# EasyEDA Pro project ProPrj_承载我所有幻想的键盘_2025-02-09.epro, schematic 04-Schematic
Create Date: 2022-12-06; Page Name: P1; Project Name: 火星号键盘V2; Schematic Name: Schematic3; Update Date: 2022-12-06; Company: 嘉立创EDA; Page Size: A4; Version: V1.0
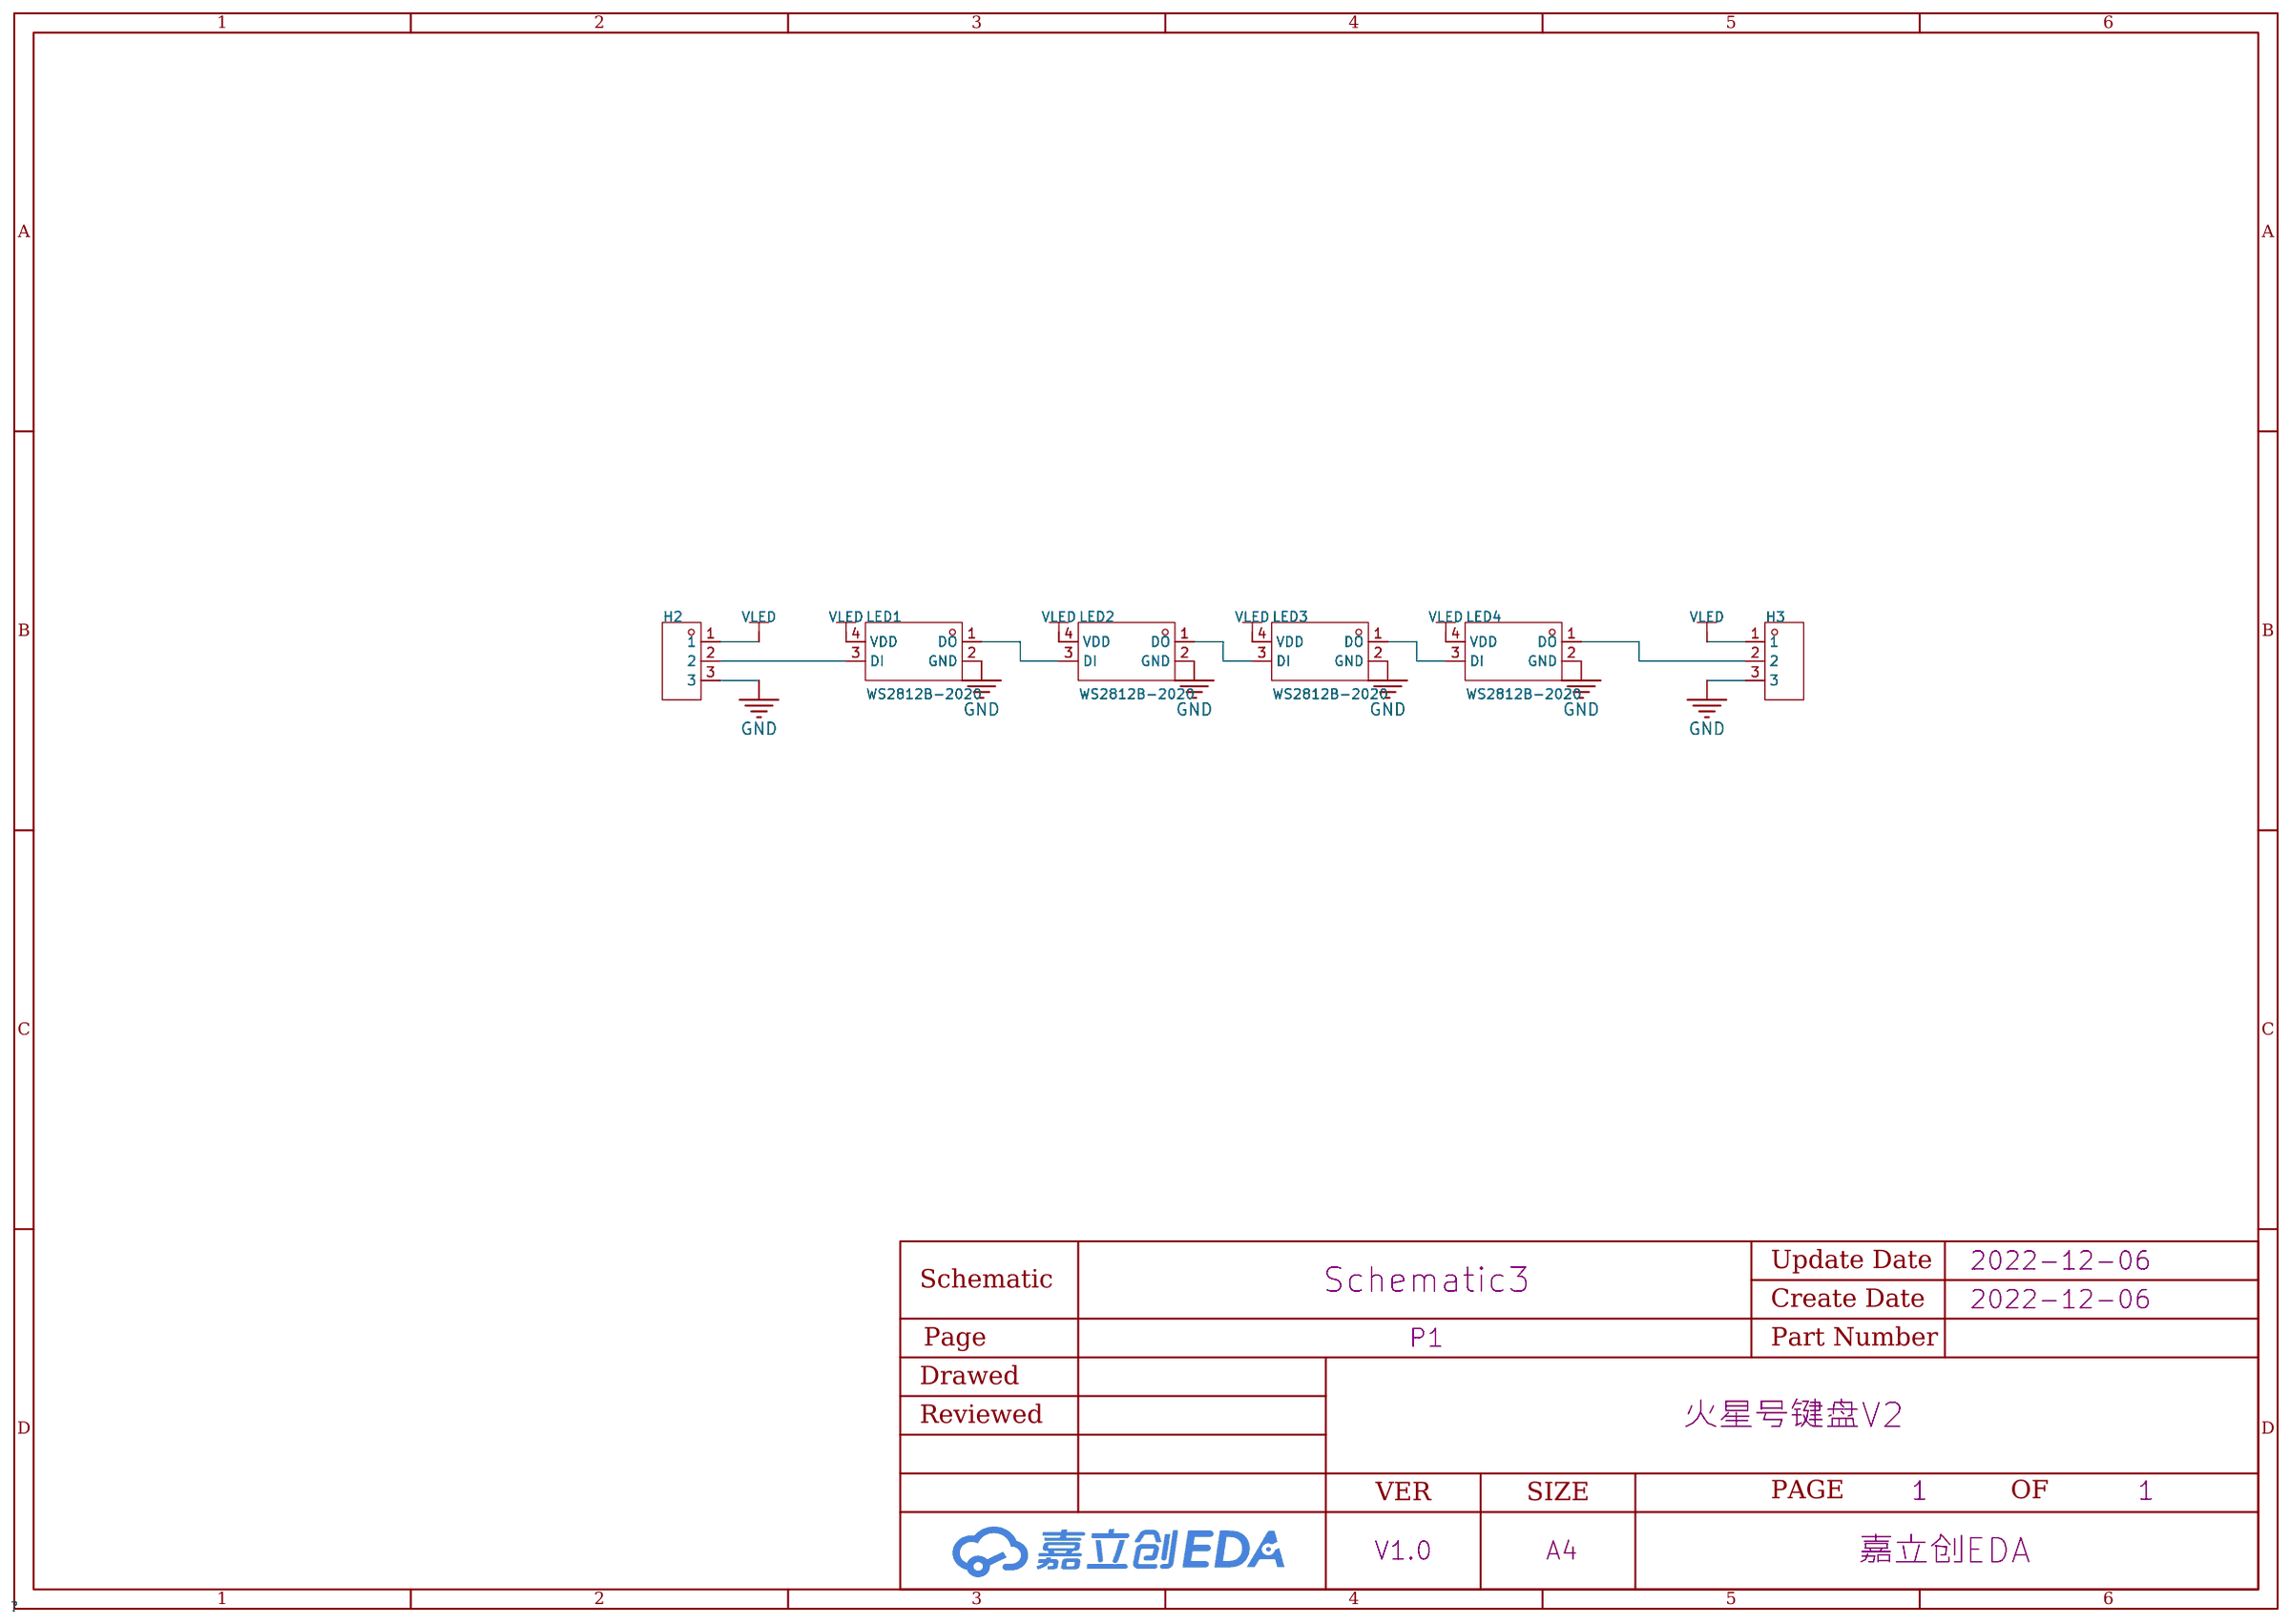
[diagram p12: schematic sheet]

## Parts
H2  -  [HDR-TH_3P-P2.54-V-M]
H3  -  [HDR-TH_3P-P2.54-V-M]
LED1  WS2812B-2020  [LED-SMD_4P-L2.0-W2.0-TL_WS2812B-2020]
LED2  WS2812B-2020  [LED-SMD_4P-L2.0-W2.0-TL_WS2812B-2020]
LED3  WS2812B-2020  [LED-SMD_4P-L2.0-W2.0-TL_WS2812B-2020]
LED4  WS2812B-2020  [LED-SMD_4P-L2.0-W2.0-TL_WS2812B-2020]

## Library data of the parts
H2 H3 = HDR-M_2.54_1x3P: Supplier Part: C2937625; Supplier Footprint: 插件
LED1-LED4 = WS2812B-2020: 发光颜色:RGB三色;二极管配置:-;透镜颜色:-;主波长:470.4nm；622.5nm；515.6nm;峰值波长:-;色温:-;测试电流:12mA;功率:-;发光角度:-;安装方式:-;工作温度:-;; LCSC Part Name: RGB三色 470.4nm 515.6nm 622.5nm （注意防潮，请查阅规格书中对应具体内容）; Supplier Part: C965555; Manufacturer: worldsemi; Supplier Footprint: SMD,2x2mm; JLCPCB Part Class: 扩展库; Datasheet: https://atta.szlcsc.com/upload/public/pdf/source/20201203/C965555_5C919C4B6231E6ADE06011FB0D94282B.pdf; Supplier: LCSC; Emitted Color: RGB三色; Dominant Wavelength: 470.4nm；622.5nm；515.6nm; Forward Current: 12mA

## Nets
GND: H2.3 H3.3 LED1.2(GND) LED2.2(GND) LED3.2(GND) LED4.2(GND)
VLED: H2.1 H3.1 LED1.4(VDD) LED2.4(VDD) LED3.4(VDD) LED4.4(VDD)
$1N1861: LED1.1(DO) LED2.3(DI)
$1N1866: LED2.1(DO) LED3.3(DI)
$1N1871: LED3.1(DO) LED4.3(DI)
Net-(H2-2): H2.2 LED1.3(DI)
Net-(H3-2): H3.2 LED4.1(DO)
